# Altium schematic sheet Ethernet v2.SchDoc
size 297 x 209 mm
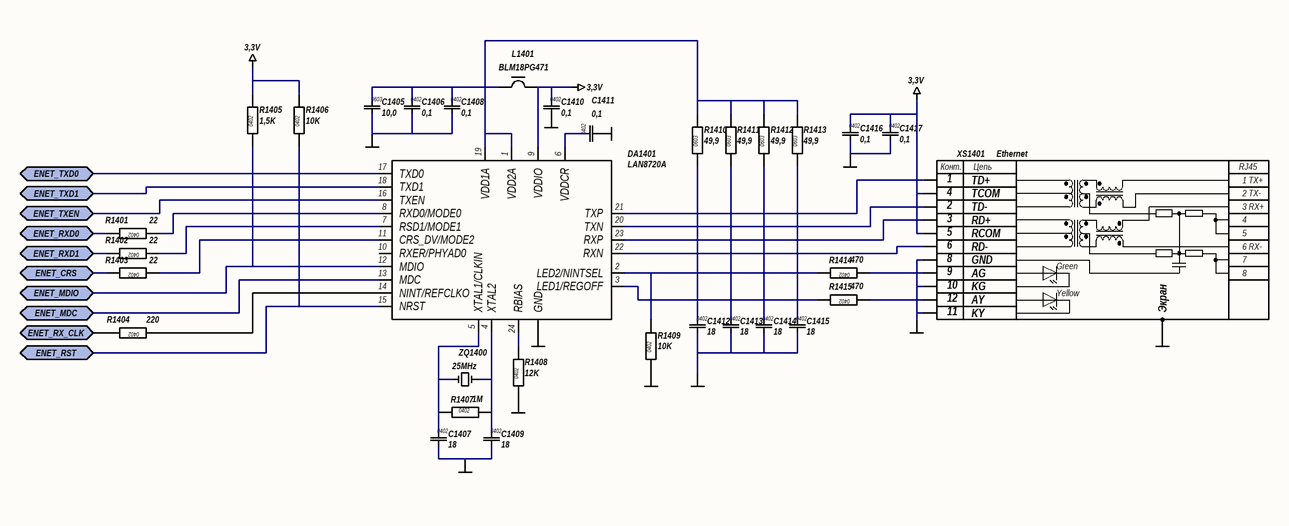
[diagram p0: Ethernet v2.SchDoc]

## Parts
C1405  10,0  [CAP0603]
C1406  0,1  [CAP0402]
C1407  18  [CAP0402]
C1408  0,1  [CAP0402]
C1409  18  [CAP0402]
C1410  0,1  [CAP0402]
C1411  0,1  [CAP0402]
C1412  18  [CAP0402]
C1413  18  [CAP0402]
C1414  18  [CAP0402]
C1415  18  [CAP0402]
C1416  0,1  [CAP0402]
C1417  0,1  [CAP0402]
DA1401  LAN8720A  [LAN8720]
L1401  BLM18PG471  [FB0603]
R1401  22  [RES0402]
R1402  22  [RES0402]
R1403  22  [RES0402]
R1404  220  [RES0402]
R1405  1,5K  [RES0402]
R1406  10K  [RES0402]
R1407  1M  [RES0402]
R1408  12K  [RES0402]
R1409  10K  [RES0402]
R1410  49,9  [RES0603]
R1411  49,9  [RES0603]
R1412  49,9  [RES0603]
R1413  49,9  [RES0603]
R1414  470  [RES0402]
R1415  470  [RES0402]
XS1401  Ethernet  [HR911105A]
ZQ1400  25MHz  [KX-7]

## Ports
ENET_CRS (bidir), ENET_MDC (bidir), ENET_MDIO (bidir), ENET_RST (bidir), ENET_RX_CLK (bidir), ENET_RXD0 (bidir), ENET_RXD1 (bidir), ENET_TXD0 (bidir), ENET_TXD1 (bidir), ENET_TXEN (bidir)

## Nets
3,3V: C1410.1 C1416.1 C1417.1 DA1401.9(VDDIO) L1401.2 R1405.2 R1406.2 XS1401.4(TCOM) XS1401.5(RCOM)
GND: C1405.2 C1406.2 C1407.2 C1408.2 C1409.2 C1410.2 C1411.2 C1412.2 C1413.2 C1414.2 C1415.2 C1416.2 C1417.2 DA1401.0(GND) R1408.1 R1409.1 XS1401.0(Экран) XS1401.8(GND) XS1401.10(KG) XS1401.11(KY)
ENET_CRS: R1403.2 ; port ENET_CRS
ENET_MDC: DA1401.13(MDC) ; port ENET_MDC
ENET_MDIO: DA1401.12(MDIO) R1405.1 ; port ENET_MDIO
ENET_RST: DA1401.15(NRST) R1406.1 ; port ENET_RST
ENET_RX_CLK: R1404.2 ; port ENET_RX_CLK
ENET_RXD0: R1401.2 ; port ENET_RXD0
ENET_RXD1: R1402.2 ; port ENET_RXD1
ENET_TXD0: DA1401.17(TXD0) ; port ENET_TXD0
ENET_TXD1: DA1401.18(TXD1) ; port ENET_TXD1
ENET_TXEN: DA1401.16(TXEN) ; port ENET_TXEN
NetC1405_1: C1405.1 C1406.1 C1408.1 DA1401.1(VDD2A) DA1401.19(VDD1A) L1401.1 R1410.2 R1411.2 R1412.2 R1413.2
NetC1407_1: C1407.1 DA1401.5(XTAL1/CLKIN) R1407.1 ZQ1400.1
NetC1409_1: C1409.1 DA1401.4(XTAL2) R1407.2 ZQ1400.3
NetC1411_1: C1411.1 DA1401.6(VDDCR)
NetC1412_1: C1412.1 DA1401.21(TXP) R1410.1 XS1401.1(TD+)
NetC1413_1: C1413.1 DA1401.20(TXN) R1411.1 XS1401.2(TD-)
NetC1414_1: C1414.1 DA1401.23(RXP) R1412.1 XS1401.3(RD+)
NetC1415_1: C1415.1 DA1401.22(RXN) R1413.1 XS1401.6(RD-)
NetDA1401_2: DA1401.2(LED2/NINTSEL) R1409.2 R1414.2
NetDA1401_3: DA1401.3(LED1/REGOFF) R1415.2
NetDA1401_7: DA1401.7(RSD1/MODE1) R1402.1
NetDA1401_8: DA1401.8(RXD0/MODE0) R1401.1
NetDA1401_11: DA1401.11(CRS_DV/MODE2) R1403.1
NetDA1401_14: DA1401.14(NINT/REFCLKO) R1404.1
NetDA1401_24: DA1401.24(RBIAS) R1408.2
NetR1414_1: R1414.1 XS1401.9(AG)
NetR1415_1: R1415.1 XS1401.12(AY)

Not connected (* = marked no-connect by the designer): DA1401 10(RXER/PHYAD0); ZQ1400 2 4

## Notes on the sheet
- (in symbol RJ45-HR911105A) Конт.; Цепь; RJ45; 1 TX+; 2 TX-; 3 RX+; 6 RX-; 7; Green; Yellow

## Library data of the parts
C1405 = CAP_0603: Конденсатор чип; Тип корпуса: 0603; Тип монтажа: Поверхностный; Номинал: 10,0; Тип компонента: Конденсатор чип; Value: 10,0
C1406-C1417 = CAP_0402: Конденсатор чип; Тип корпуса: 0402; Тип монтажа: Поверхностный; Тип компонента: Конденсатор чип
  C1406 C1408 C1410 C1411 C1416 C1417: Номинал: 0,1; Value: 0,1
  C1407 C1409 C1412-C1415: Номинал: 18; Value: 18
DA1401 = LAN8720A: Интерфейс Ethernet; Производитель: SMSC; Тип корпуса: VQFN24; Тип монтажа: Поверхностный; Характеристики: 10/100Мбит; Наименование: LAN8720A; Тип компонента: Интерфейс Ethernet
L1401 = BLM18PG: Ферритовая бусина; Производитель: Murata; Тип корпуса: 0603; Тип монтажа: Поверхностный; Наименование: BLM18PG471; Тип компонента: Ферритовая бусина
R1401-R1409 R1414 R1415 = RES_0402: Резистор чип; Тип корпуса: 0402; Тип монтажа: Поверхностный; Характеристики: 0.062Вт 50В; Тип компонента: Резистор чип
  R1401-R1403: Номинал: 22; Value: 22
  R1404: Номинал: 220; Value: 220
  R1405: Номинал: 1,5K; Value: 1,5K
  R1406 R1409: Номинал: 10K; Value: 10K
  R1407: Номинал: 1M; Value: 1M
  R1408: Номинал: 12K; Value: 12K
  R1414 R1415: Номинал: 470; Value: 470
R1410-R1413 = RES_0603: Резистор чип; Тип корпуса: 0603; Тип монтажа: Поверхностный; Характеристики: 0.1Вт 50В; Номинал: 49,9; Тип компонента: Резистор чип; Value: 49,9
XS1401 = RJ45-HR911105A: Разъем RJ45 с трансформатором и LED; Производитель: Hanrun; Тип монтажа: Штыревой; Тип компонента: Разъем RJ45 с трансформатором и LED
ZQ1400 = KX-7: Кварц; Производитель: Geyer; Тип монтажа: Поверхностный; Номинал: 25MHz; Тип компонента: Кварц; Тип корпуса: KX-7; Value: 25MHz